# EAGLE board PX4FMUv1.7 (EAGLE 6.2)
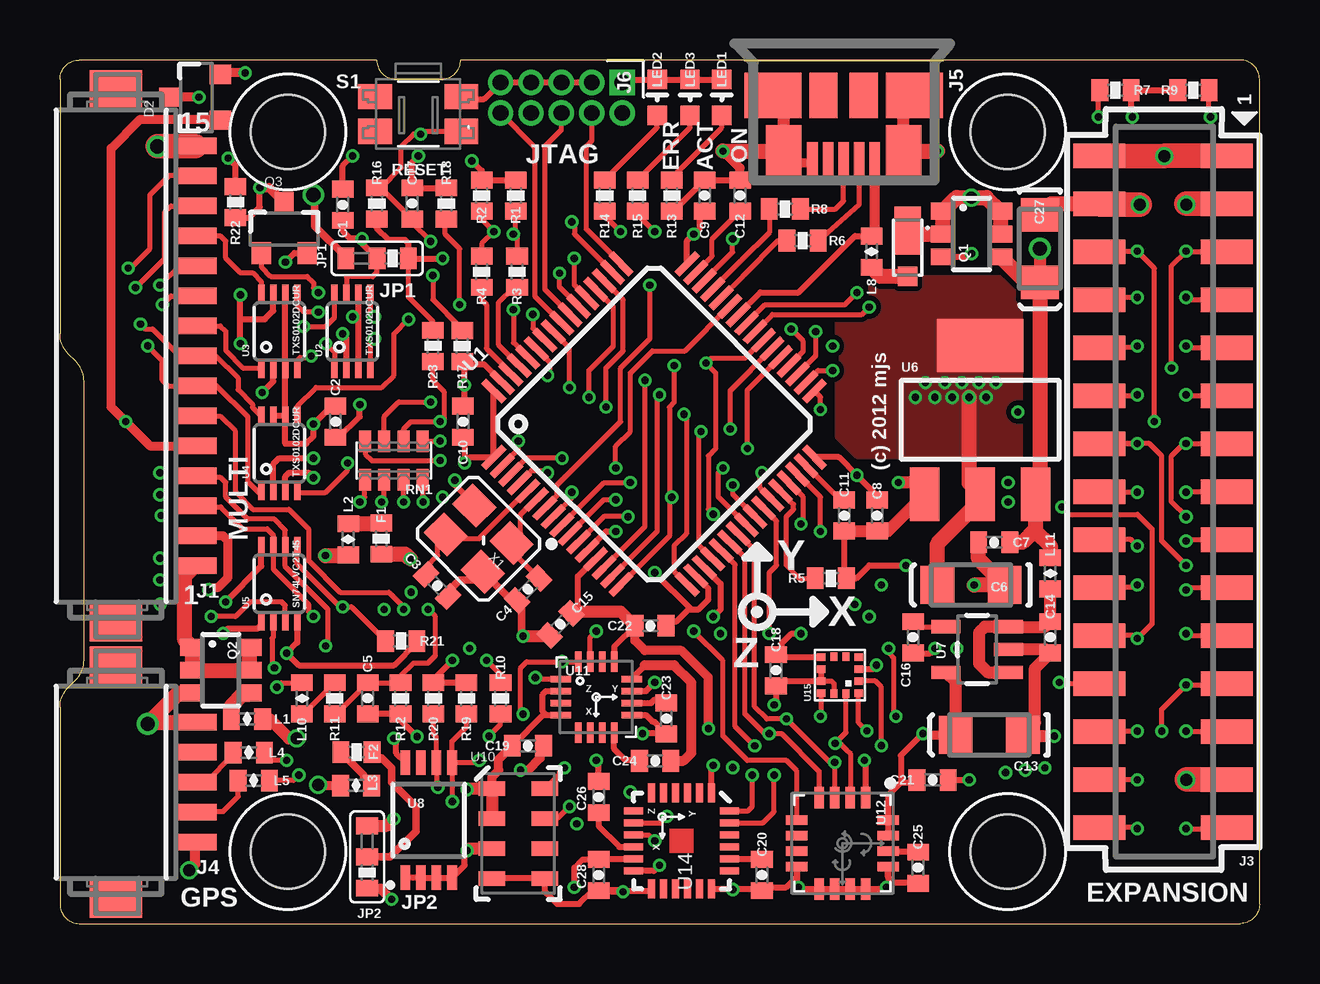
[diagram p3: board, top side]
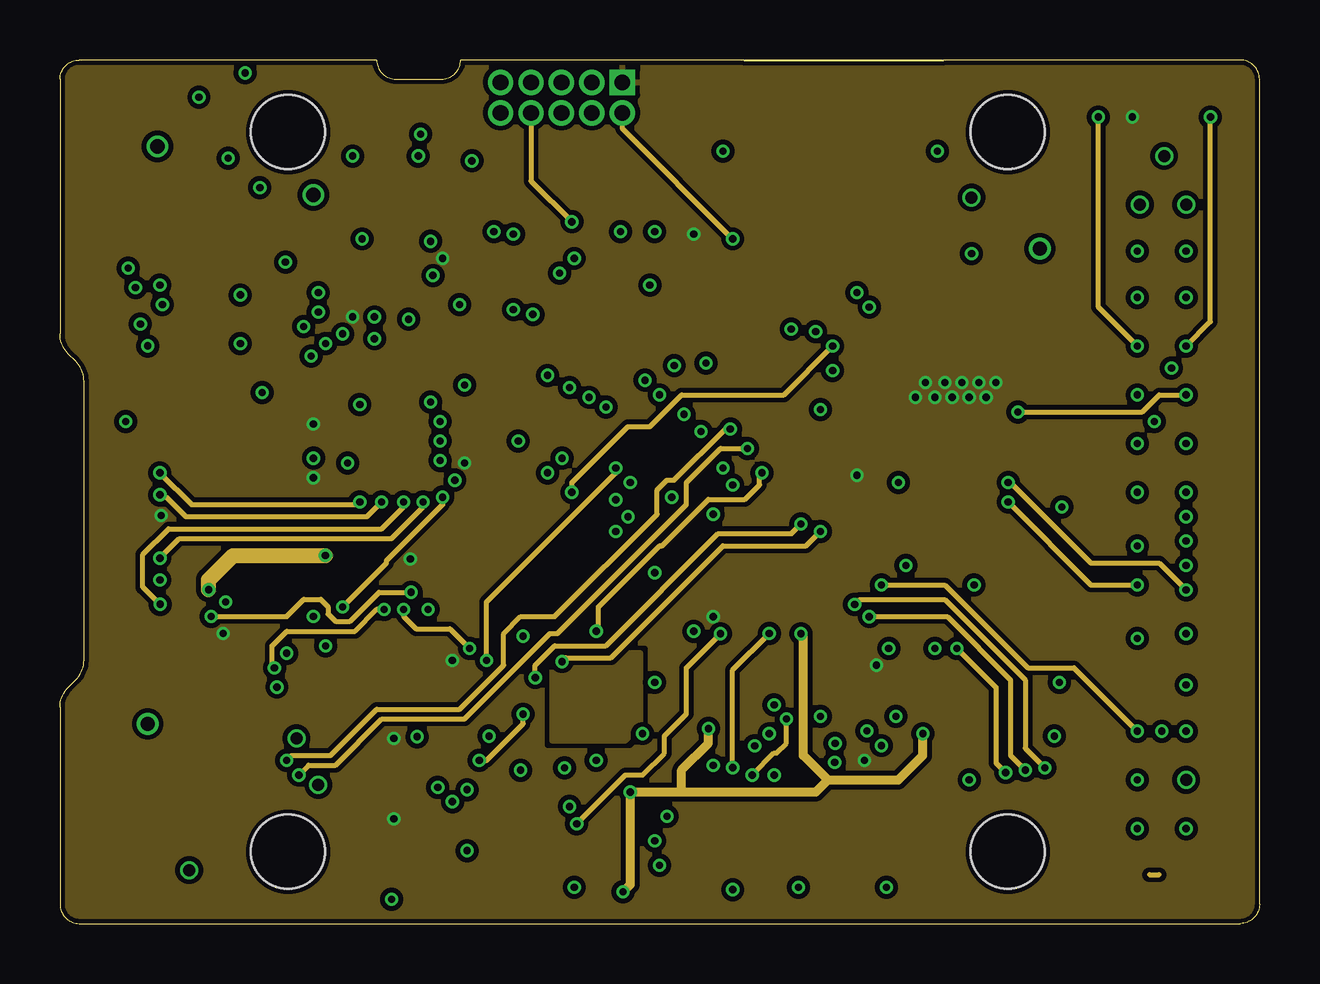
[diagram p4: board, inner layer Route2]
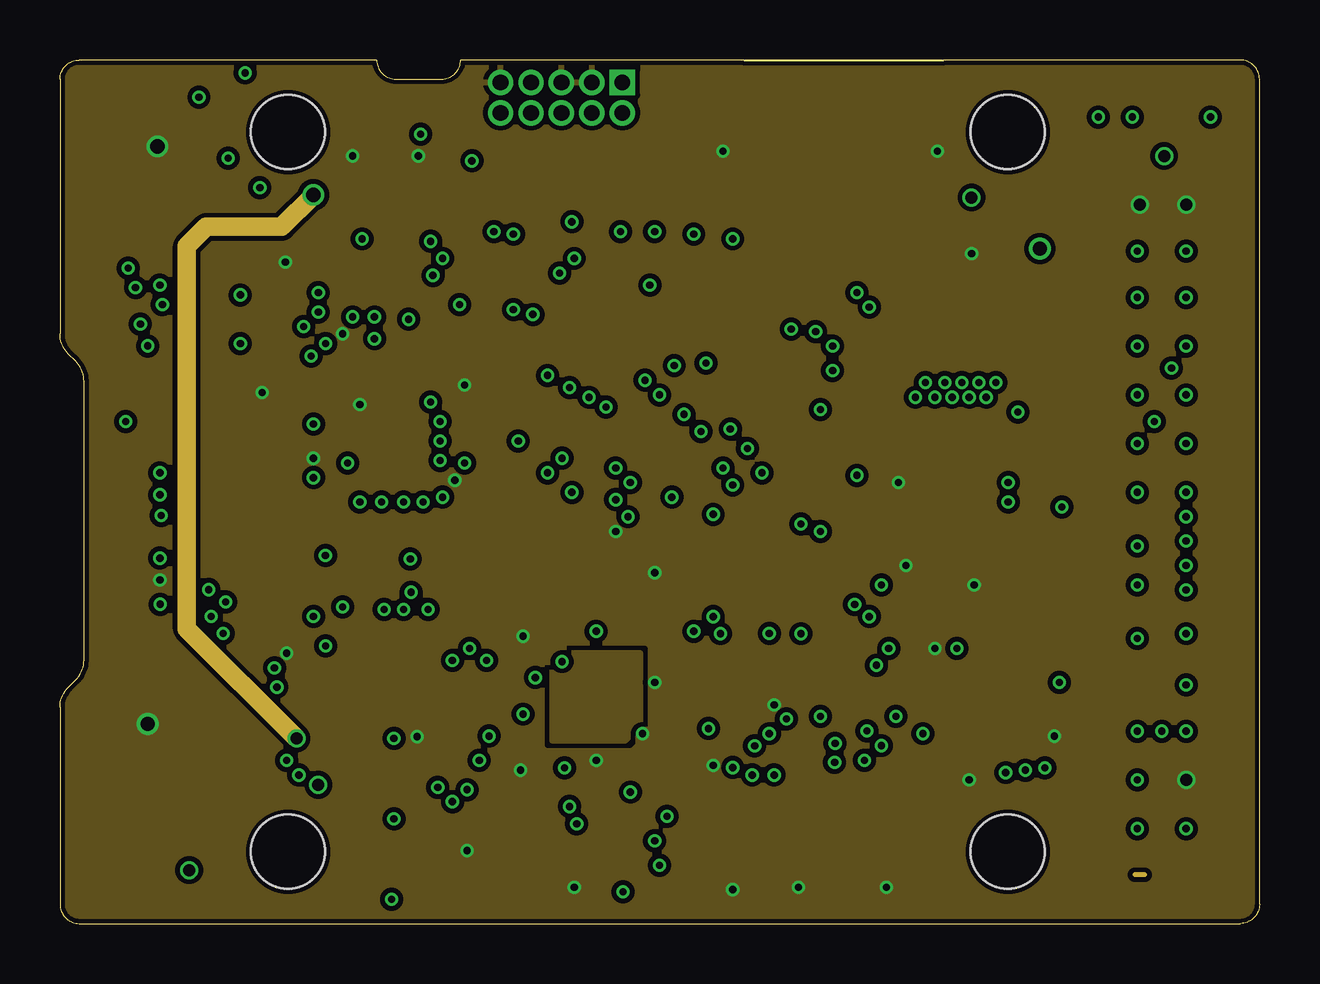
[diagram p5: board, inner layer Route15]
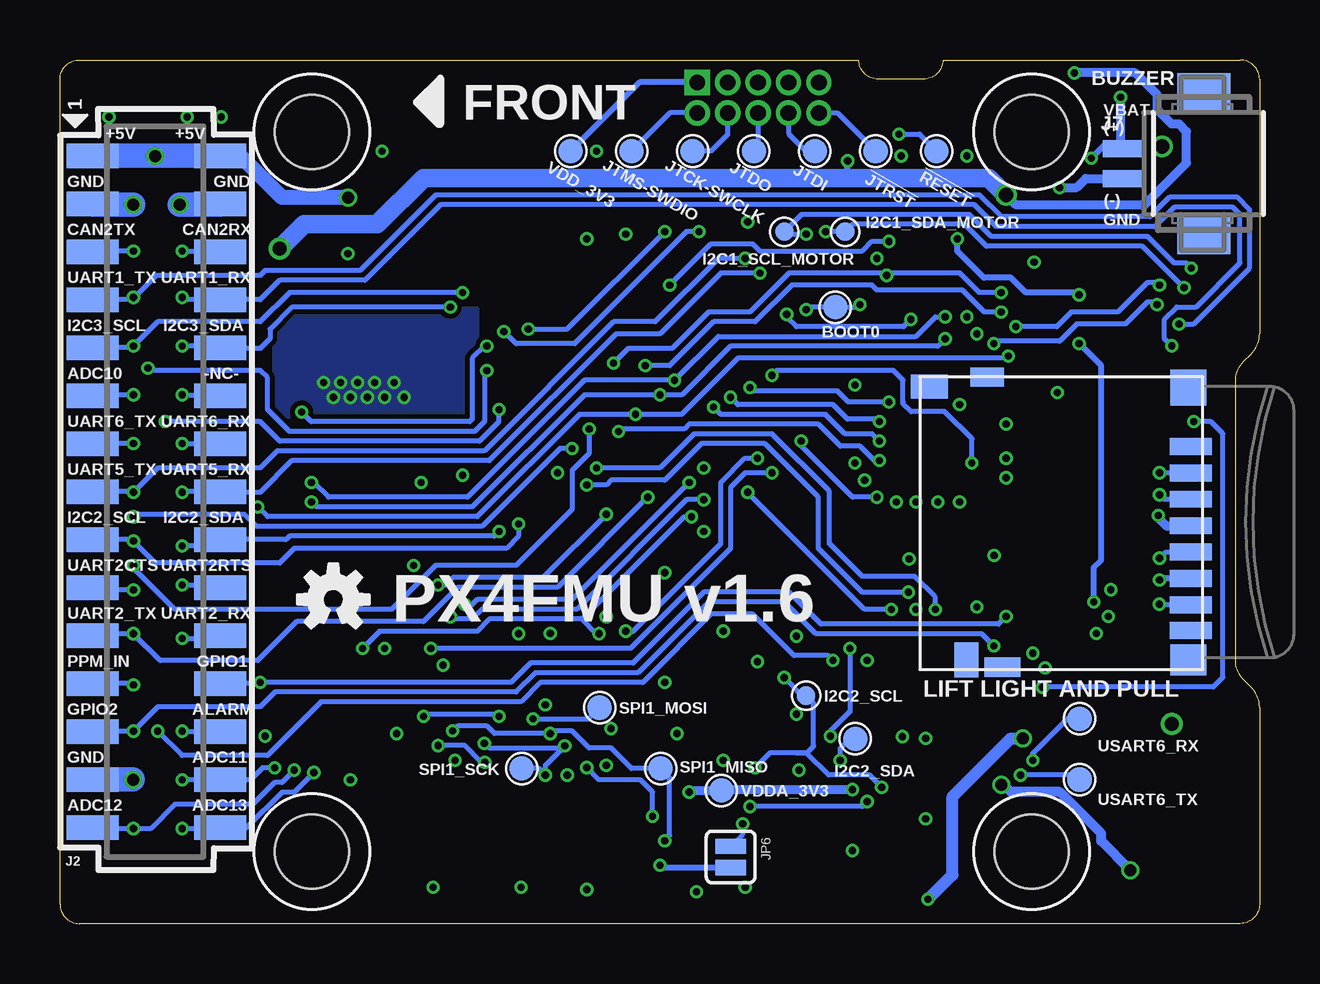
[diagram p6: board, bottom side, seen from below]

Size 50 x 36 mm. Coordinates in mm from the lower left corner, seen from the top.
Outline: 0,0.8 arc90 0.8,0 49.2,0 arc90 50,0.8 50,35.2 arc90 49.2,36 16.7,36 arc-90 15.9,35.2 14,35.2 arc-90 13.2,36 0.8,36 arc90 0,35.2 0,24.6 arc45 0.35,23.75 0.65,23.45 arc-45 1,22.6 1,11 arc-45 0.65,10.15 0.35,9.85 arc45 0,9 0,0.8
Copper layers (1*2*15*16): Top 0.035mm / dielectric 0.5mm / Route2 0.035mm / dielectric 0.5mm / Route15 0.035mm / dielectric 0.5mm / Bottom 0.035mm
Design rules: minimum track width 0.15mm, minimum drill 0.3mm, track to track 0.15mm, track to pad 0.15mm, pad to pad 0.15mm, via to via 0.15mm, smd to smd 0.15mm, copper to edge 0.2mm, drill to drill 0.2mm, minimum pad ring 0.125mm, minimum via ring 0.125mm, stop-mask expansion 1mil, vias tented up to drill 0.31mm, thermal gap 8mil
Net classes: 0 signal: width 0.203 mm, drill 0.3 mm, clearance 0.203 mm; 1 power: width 0.254 mm, drill 0.3 mm, clearance 0.203 mm

## Footprints (pad centres in the part's own frame; a part is rotated, then mirrored left to right if it is on the bottom)
PAD.04X.04 = smd 1.016 x 1.016: P$1 0,0
0402-CAP = smd 0.7 x 0.9: 1 -0.65,0; 2 0.65,0
EIA3216 = smd 1.4 x 1.6: A 1.4,0; C -1.4,0
MICROSMP = smd 0.8 x 0.8: ANODE 0.65,0 | smd 2 x 1.1: CATHODE -1.25,0
SOT23-3 = smd 0.8 x 0.9: 1 -0.95,-1; 2 0.95,-1; 3 0,1.1
0402-PTC = smd 0.7 x 0.9: 1 -0.65,0; 2 0.65,0
PAD.03X.03 = smd 0.762 x 0.762: P$1 0,0
DF13A-15P-1.25H = smd 0.7 x 1.8: 1 -8.75,-3.3; 2 -7.5,-3.3; 3 -6.25,-3.3; 4 -5,-3.3; 5 -3.75,-3.3; 6 -2.5,-3.3; 7 -1.25,-3.3; 8 0,-3.3; 9 1.25,-3.3; 10 2.5,-3.3; 11 3.75,-3.3; 12 5,-3.3; 13 6.25,-3.3; 14 7.5,-3.3; 15 8.75,-3.3 | smd 1.6 x 2.2: S1 11.1,0; S2 -11.1,0
HEADER_2MM_2X15_REVERSE = smd 1.02 x 2.16: 1 -14,-2.655; 2 -14,2.655; 3 -12,-2.655; 4 -12,2.655; 5 -10,-2.655; 6 -10,2.655; 7 -8,-2.655; 8 -8,2.655; 9 -6,-2.655; 10 -6,2.655; 11 -4,-2.655; 12 -4,2.655; 13 -2,-2.655; 14 -2,2.655; 15 0,-2.655; 16 0,2.655; 17 2,-2.655; 18 2,2.655; 19 4,-2.655; 20 4,2.655; 21 6,-2.655; 22 6,2.655; 23 8,-2.655; 24 8,2.655; 25 10,-2.655; 26 10,2.655; 27 12,-2.655; 28 12,2.655; 29 14,-2.655; 30 14,2.655
HEADER_2MM_2X15 = smd 1.02 x 2.16: 1 14,-2.655; 2 14,2.655; 3 12,-2.655; 4 12,2.655; 5 10,-2.655; 6 10,2.655; 7 8,-2.655; 8 8,2.655; 9 6,-2.655; 10 6,2.655; 11 4,-2.655; 12 4,2.655; 13 2,-2.655; 14 2,2.655; 15 0,-2.655; 16 0,2.655; 17 -2,-2.655; 18 -2,2.655; 19 -4,-2.655; 20 -4,2.655; 21 -6,-2.655; 22 -6,2.655; 23 -8,-2.655; 24 -8,2.655; 25 -10,-2.655; 26 -10,2.655; 27 -12,-2.655; 28 -12,2.655; 29 -14,-2.655; 30 -14,2.655
DF13A-5P-1.25H = smd 0.7 x 1.8: 1 -2.5,-3.3; 2 -1.25,-3.3; 3 0,-3.3; 4 1.25,-3.3; 5 2.5,-3.3 | smd 1.6 x 2.2: S1 4.85,0; S2 -4.85,0
MOLEX-47346-0001 = smd 1.7 x 0.44: D+ 2.8,0; D- 2.8,0.65; GND 2.8,-1.3; ID 2.8,-0.65; VBUS 2.8,1.3 | smd 1.9 x 2.375: GND1 0,2.95; GND4 0,-2.95 | smd 2.1 x 1.475: GND2 2.3,2.5; GND3 2.3,-2.5 | smd 1.9 x 1.175: GND5 0,-0.838; GND6 0,0.838
FTSH-105-01-XXX-DV = drill 0.65 pad 1.06 square: 1 0,0 | drill 0.65 pad 1.06: 2 0,1.27; 3 1.27,0; 4 1.27,1.27; 5 2.54,0; 6 2.54,1.27; 7 3.81,0; 8 3.81,1.27; 9 5.08,0; 10 5.08,1.27
DF13A-2P-1.25H = smd 0.7 x 1.8: 1 -0.605,-3.3; 2 0.645,-3.3 | smd 1.6 x 2.2: S1 2.995,0; S2 -2.955,0
SJ_3_0603_PASTE1&2 = smd 0.7 x 0.9: 1 -0.65,0; 2 0.65,0; 3 1.95,0
SJ_2 = smd 0.635 x 1.27: 1 -0.889,0; 2 0,0
0402-IND = smd 0.7 x 0.9: 1 -0.65,0; 2 0.65,0
LED-0603 = smd 0.8 x 0.8: A 0,-0.75; C 0,0.75
TSOP-6@1 = smd 0.7 x 1: 1 -0.95,-1.2; 2 0,-1.2; 3 0.95,-1.2; 4 0.95,1.2; 5 0,1.2; 6 -0.95,1.2
0402-RES = smd 0.7 x 0.9: 1 -0.65,0; 2 0.65,0
CTS742C083 = smd 0.5 x 0.9: 1 -1.2,-0.8; 2 -0.4,-0.8; 3 0.4,-0.8; 4 1.2,-0.8; 5 1.2,0.8; 6 0.4,0.8; 7 -0.4,0.8; 8 -1.2,0.8
EVQP7J01K = smd 1.4 x 1.05: A1 -1.8,0.725; A2 1.8,0.725; B3 -1.8,-0.725; B4 1.8,-0.725
TQFP64 = smd 1.2 x 0.29: 1 -5.7,3.75; 2 -5.7,3.25; 3 -5.7,2.75; 4 -5.7,2.25; 5 -5.7,1.75; 6 -5.7,1.25; 7 -5.7,0.75; 8 -5.7,0.25; 9 -5.7,-0.25; 10 -5.7,-0.75; 11 -5.7,-1.25; 12 -5.7,-1.75; 13 -5.7,-2.25; 14 -5.7,-2.75; 15 -5.7,-3.25; 16 -5.7,-3.75; 33 5.7,-3.75; 34 5.7,-3.25; 35 5.7,-2.75; 36 5.7,-2.25; 37 5.7,-1.75; 38 5.7,-1.25; 39 5.7,-0.75; 40 5.7,-0.25; 41 5.7,0.25; 42 5.7,0.75; 43 5.7,1.25; 44 5.7,1.75; 45 5.7,2.25; 46 5.7,2.75; 47 5.7,3.25; 48 5.7,3.75 | smd 0.29 x 1.2: 17 -3.75,-5.7; 18 -3.25,-5.7; 19 -2.75,-5.7; 20 -2.25,-5.7; 21 -1.75,-5.7; 22 -1.25,-5.7; 23 -0.75,-5.7; 24 -0.25,-5.7; 25 0.25,-5.7; 26 0.75,-5.7; 27 1.25,-5.7; 28 1.75,-5.7; 29 2.25,-5.7; 30 2.75,-5.7; 31 3.25,-5.7; 32 3.75,-5.7; 49 3.75,5.7; 50 3.25,5.7; 51 2.75,5.7; 52 2.25,5.7; 53 1.75,5.7; 54 1.25,5.7; 55 0.75,5.7; 56 0.25,5.7; 57 -0.25,5.7; 58 -0.75,5.7; 59 -1.25,5.7; 60 -1.75,5.7; 61 -2.25,5.7; 62 -2.75,5.7; 63 -3.25,5.7; 64 -3.75,5.7
TI-DCU = smd 0.27 x 0.8: 1 -0.75,-1.55; 2 -0.25,-1.55; 3 0.25,-1.55; 4 0.75,-1.55; 5 0.75,1.55; 6 0.25,1.55; 7 -0.25,1.55; 8 -0.75,1.55
SOT-223 = smd 1.219 x 2.235: 1 -2.311,-3.099; 2 0,-3.099; 3 2.311,-3.099 | smd 3.6 x 2.2: 4 0,3.099
SOT23-5 = smd 0.55 x 1.2: 1 -0.95,-1.3; 2 0,-1.3; 3 0.95,-1.3; 4 0.95,1.3; 5 -0.95,1.3
MSOP-8 = smd 0.4 x 1.02: 1 -0.975,-2.4; 2 -0.325,-2.4; 3 0.325,-2.4; 4 0.975,-2.4; 5 0.975,2.4; 6 0.325,2.4; 7 -0.325,2.4; 8 -0.975,2.4
MS5611-01BA = smd 1.1 x 0.6: 1 -1.1,1.875; 2 -1.1,0.625; 3 -1.1,-0.625; 4 -1.1,-1.875; 5 1.1,-1.875; 6 1.1,-0.625; 7 1.1,0.625; 8 1.1,1.875
HMC5883L-MAN = smd 0.85 x 0.285: 1 -1.475,0.75; 2 -1.475,0.25; 3 -1.475,-0.25; 4 -1.475,-0.75; 9 1.475,-0.75; 10 1.475,-0.25; 11 1.475,0.25; 12 1.475,0.75 | smd 0.285 x 0.85: 5 -0.75,-1.475; 6 -0.25,-1.475; 7 0.25,-1.475; 8 0.75,-1.475; 13 0.75,1.475; 14 0.25,1.475; 15 -0.25,1.475; 16 -0.75,1.475
L3G4200DH-MAN = smd 0.9 x 0.4: 1 -1.9,0.975; 2 -1.9,0.325; 3 -1.9,-0.325; 4 -1.9,-0.975; 9 1.9,-0.975; 10 1.9,-0.325; 11 1.9,0.325; 12 1.9,0.975 | smd 0.4 x 0.9: 5 -0.975,-1.9; 6 -0.325,-1.9; 7 0.325,-1.9; 8 0.975,-1.9; 13 0.975,1.9; 14 0.325,1.9; 15 -0.325,1.9; 16 -0.975,1.9
AMPHENOL_114-00841-68 = smd 0.7 x 1.75: P$1 7.7,-1; P$2 6.6,-1; P$3 5.5,-1; P$4 4.4,-1; P$5 3.3,-1; P$6 2.2,-1; P$7 1.1,-1; P$8 0.04,-1 | smd 1.5 x 1.5: P$9 10.15,-0.9 | smd 1.3 x 1.5: P$10 -1.2,-0.9 | smd 0.8 x 1.5: P$11 -1.5,6.85 | smd 1.45 x 1: P$12 -1.2,8.35 | smd 0.8 x 1.4: P$13 10.6,7.5 | smd 1 x 1.55: P$14 10.2,9.9
QFN-24 = smd 0.8 x 0.29: 1 -2,1.25; 2 -2,0.75; 3 -2,0.25; 4 -2,-0.25; 5 -2,-0.75; 6 -2,-1.25; 13 2,-1.25; 14 2,-0.75; 15 2,-0.25; 16 2,0.25; 17 2,0.75; 18 2,1.25 | smd 0.29 x 0.8: 7 -1.25,-2; 8 -0.75,-2; 9 -0.25,-2; 10 0.25,-2; 11 0.75,-2; 12 1.25,-2; 19 1.25,2; 20 0.75,2; 21 0.25,2; 22 -0.25,2; 23 -0.75,2; 24 -1.25,2
BMA280 = smd 0.3 x 0.35: 1 -0.75,-0.775; 2 -0.25,-0.775; 3 0.25,-0.775; 4 0.75,-0.775; 7 0.75,0.775; 8 0.25,0.775; 9 -0.25,0.775; 10 -0.75,0.775 | smd 0.35 x 0.3: 5 0.775,-0.25; 6 0.775,0.25; 11 -0.775,0.25; 12 -0.775,-0.25
MOUNT-HOLE3.1 = hole 3.1: 0,0
OSCILLATOR-3.2X2.5 = smd 1.4 x 1.2: 1 -1.1,-0.85; 2 1.1,-0.85; 3 1.1,0.85; 4 -1.1,0.85

## Placement (x,y rotation side)
!JTRST  PAD.04  [PAD.04X.04]  16,32.2 315 bottom
!RESET  PAD.04  [PAD.04X.04]  13.46,32.2 315 bottom
BOOT0  PAD.04  [PAD.04X.04]  17.68,25.7 0 bottom
C1  0u1  [0402-CAP]  11.79,29.96 90 top
C2  0u1  [0402-CAP]  11.48,20.92 270 top
C3  8p  [0402-CAP]  15.72,14.09 315 top
C4  8p  [0402-CAP]  19.51,13.93 45 top
C5  0u1  [0402-CAP]  12.83,9.39 270 top
C6  10u  [EIA3216]  37.97,14.11 180 top
C7  0u1  [0402-CAP]  38.94,15.89 180 top
C8  0u1  [0402-CAP]  34.06,17.01 270 top
C9  0u1  [0402-CAP]  26.87,30.34 90 top
C10  0u1  [0402-CAP]  16.8,20.92 90 top
C11  2u2  [0402-CAP]  32.69,17.01 270 top
C12  2u2  [0402-CAP]  28.35,30.34 90 top
C13  10u  [EIA3216]  38.73,7.87 180 top
C14  0u1  [0402-CAP]  41.27,11.93 270 top
C15  0u1  [0402-CAP]  20.86,12.47 225 top
C16  470p  [0402-CAP]  35.56,11.93 270 top
C17  0u1  [0402-CAP]  14.68,30.01 270 top
C18  0u1  [0402-CAP]  29.84,10.56 270 top
C19  0u1  [0402-CAP]  19.51,7.41 0 top
C20  0u01  [0402-CAP]  29.26,2.02 270 top
C21  0u1  [0402-CAP]  36.37,5.99 0 top
C22  0u1  [0402-CAP]  24.61,12.41 0 top
C23  4u7  [0402-CAP]  25.27,8.55 270 top
C24  0u22  [0402-CAP]  24.81,6.78 0 top
C25  0u01  [0402-CAP]  35.76,2.33 270 top
C26  2u2  [0402-CAP]  22.45,5.28 90 top
C27  10u  [EIA3216]  40.84,28.14 270 top
C28  2u2  [0402-CAP]  22.45,2.02 90 top
D1  MSS1P4-M3  [MICROSMP]  35.33,27.63 270 top
D2  BAT54C  [SOT23-3]  5.69,34.44 90 top
F1  500mA  [0402-PTC]  13.39,16.04 90 top
F2  200mA  [0402-PTC]  12.36,7.14 180 top
I2C1_SCL_MOTOR  PAD.03  [PAD.03X.03]  19.81,28.84 0 bottom
I2C1_SDA_MOTOR  PAD.03  [PAD.03X.03]  17.27,28.84 0 bottom
I2C2_SCL  PAD.03  [PAD.03X.03]  18.9,9.5 0 bottom
I2C2_SDA  PAD.04  [PAD.04X.04]  16.85,7.7 0 bottom
J1  DF13-15P-1.25H  [DF13A-15P-1.25H]  2.34,23.66 90 top
J2  HEADER_2X15-REV  [HEADER_2MM_2X15_REVERSE]  45.97,18.01 270 bottom
J3  HEADER_2X15  [HEADER_2MM_2X15]  45.97,18.01 90 top
J4  DF13-5P-1.25H  [DF13A-5P-1.25H]  2.34,5.89 90 top
J5  47346-0001  [MOLEX-47346-0001]  32.66,34.53 270 top
J6  ARM_MINI_JTAG-TH  [FTSH-105-01-XXX-DV]  23.44,35.07 180 top
J7  DF13-2P-1.25H  [DF13A-2P-1.25H]  2.33,31.7 270 bottom
JP1  0R  [SJ_3_0603_PASTE1&2]  13.87,27.73 180 top
JP2  0R  [SJ_3_0603_PASTE1&2]  12.8,2.13 90 top
JP6  JUMPER-2  [SJ_2]  22.05,2.33 270 bottom
JTCK-SWCLK  PAD.04  [PAD.04X.04]  23.63,32.2 315 bottom
JTDI  PAD.04  [PAD.04X.04]  18.54,32.2 315 bottom
JTDO  PAD.04  [PAD.04X.04]  21.08,32.2 315 bottom
JTMS-SWDIO  PAD.04  [PAD.04X.04]  26.17,32.2 315 bottom
L1  FERRITE  [0402-IND]  7.8,8.53 180 top
L2  FERRITE  [0402-IND]  12.01,16.02 270 top
L3  FERRITE  [0402-IND]  12.34,5.76 180 top
L4  BLM15HD102SN1  [0402-IND]  7.87,7.13 180 top
L5  BLM15HD102SN1  [0402-IND]  8.08,5.96 180 top
L8  FERRITE  [0402-IND]  33.83,28.01 90 top
L10  BLM15HD102SN1  [0402-IND]  10.08,9.39 90 top
L11  FERRITE  [0402-IND]  41.27,14.6 270 top
LED1  GREEN  [LED-0603]  27.58,34.43 180 top
LED2  AMBER  [LED-0603]  24.89,34.43 180 top
LED3  BLUE  [LED-0603]  26.26,34.43 180 top
Q1  NTGS4111P  [TSOP-6@1]  38,28.74 270 top
Q2  NTGS4111P  [TSOP-6@1]  6.71,10.56 270 top
Q3  ZXMS6004FFTA  [SOT23-3]  9.35,28.95 0 top
R1  1K5  [0402-RES]  19,30.34 90 top
R2  1K5  [0402-RES]  17.58,30.34 90 top
R3  100  [0402-RES]  19.05,27.17 90 top
R4  100  [0402-RES]  17.58,27.17 90 top
R5  10K  [0402-RES]  32.13,14.39 0 top
R6  22R  [0402-RES]  30.96,28.47 180 top
R7  1K5  [0402-RES]  43.99,34.74 0 top
R8  22R  [0402-RES]  30.22,29.78 180 top
R9  1K5  [0402-RES]  47.24,34.74 180 top
R10  1K0  [0402-RES]  18.36,9.39 270 top
R11  47K/0.1%  [0402-RES]  11.46,9.39 90 top
R12  10K/0.1%  [0402-RES]  14.2,9.39 90 top
R13  270R  [0402-RES]  25.5,30.34 90 top
R14  270R  [0402-RES]  22.71,30.34 90 top
R15  82R  [0402-RES]  24.08,30.34 90 top
R16  10K  [0402-RES]  13.21,30.01 270 top
R17  10K  [0402-RES]  16.76,24.07 90 top
R18  10K  [0402-RES]  16.1,30.01 270 top
R19  1K5  [0402-RES]  16.94,9.39 90 top
R20  1K5  [0402-RES]  15.57,9.39 90 top
R21  10K  [0402-RES]  14.22,11.78 180 top
R22  10K  [0402-RES]  7.32,30.07 90 top
R23  10K  [0402-RES]  15.54,24.08 90 top
RN1  CTS742C083  [CTS742C083]  13.92,19.3 180 top
S1  RESET  [EVQP7J01K]  14.94,33.75 180 top
SPI1_MISO  PAD.04  [PAD.04X.04]  24.97,6.46 315 bottom
SPI1_MOSI  PAD.04  [PAD.04X.04]  27.51,9 0 bottom
SPI1_SCK  PAD.04  [PAD.04X.04]  30.76,6.46 315 bottom
U1  STM32F405RGT6  [TQFP64]  24.77,20.82 45 top
U2  TXS0102DCUR  [TI-DCU]  12.19,24.68 0 top
U3  TXS0102DCUR  [TI-DCU]  9.14,24.68 0 top
U4  TXS0102DCUR  [TI-DCU]  9.14,19.6 0 top
U5  SN74LVC2T45  [TI-DCU]  9.14,14.17 0 top
U6  LD1117AS33  [SOT-223]  38.35,21 0 top
U7  MIC5207  [SOT23-5]  38.23,11.42 90 top
U8  128KBit EEPROM  [MSOP-8]  15.37,4.31 0 top
U10  MS5611-01BA  [MS5611-01BA]  19.1,3.75 0 top
U11  HMC5883L  [HMC5883L-MAN]  22.35,9.44 0 top
U12  L3GD20  [L3G4200DH-MAN]  32.61,3.34 270 top
U13  AMP 114-00841-68  [AMPHENOL_114-00841-68]  3.86,12.18 90 bottom
U14  MPU-6000  [QFN-24]  25.91,3.45 270 top
U15  BMA280  [BMA280]  32.51,10.36 90 top
U$1  MOUNT-HOLE3.1MM  [MOUNT-HOLE3.1]  39.5,3 0 top
U$2  MOUNT-HOLE3.1MM  [MOUNT-HOLE3.1]  9.5,33 0 top
U$3  MOUNT-HOLE3.1MM  [MOUNT-HOLE3.1]  9.5,3 0 top
U$4  MOUNT-HOLE3.1MM  [MOUNT-HOLE3.1]  39.5,33 0 top
U$7  OSHW-LOGOS  [OSHW-LOGO-S]  38.61,13.5 0 bottom
USART6_RX  PAD.04  [PAD.04X.04]  7.5,8.54 0 bottom
USART6_TX  PAD.04  [PAD.04X.04]  7.5,6 0 bottom
VDD_3V3  PAD.04  [PAD.04X.04]  28.71,32.2 315 bottom
VDDA_3V3  PAD.04  [PAD.04X.04]  22.43,5.55 0 bottom
X1  24 MHz 3.2x2.5mm 8-10pf  [OSCILLATOR-3.2X2.5]  17.45,16.04 135 top

## Tracks (layer width: path | path; a pad name or v marks a point on that pad's centre or on a via)
!JTRST
  Top 0.203: U1.56 19.81,26.13 19.81,32.35 J6.10
  Bottom 0.203: !JTRST.P$1 17.6,33.8 J6.10
ACCEL_CS  (via drill 0.3)
  Top 0.203: U1.4 19.65,18.89 20.22,18.89 v20.32,18.79 | v34.54,11.47 34.54,11.28 34.75,11.07 34.75,8.74 v34.85,8.64 | U15.10 31.74,8.67 v31.7,8.64
  Bottom 0.203: v20.32,18.79 21.44,18.79 22.05,18.18 22.05,15.64 26.21,11.47 v34.54,11.47 | v34.85,8.64 34.75,8.74 31.8,8.74 v31.7,8.64
ADC123_IN10  (via drill 0.3)
  Top 0.203: v21.34,17.98 21.34,17.74 U1.8 | R11.1 11.53,8.74 C5.1 R12.2 14.22,10.06 14.22,10.36 14.73,10.86 15.34,10.86 15.65,11.17 15.65,12.79 v15.34,13.1 | J3.11 46.97,22.01 v46.94,22.04
  Route2 0.203: v21.34,17.98 21.34,18.38 23.67,20.72 24.59,20.72 25.91,22.04 30.18,22.04 v32.21,24.07 | v39.93,21.33 45.11,21.33 45.82,22.04 v46.94,22.04
  Bottom 0.203: v15.34,13.1 16.46,13.1 v21.34,17.98 | v46.94,22.04 48.6,22.04 J3.11 | v32.21,24.07 32.31,24.07 32.82,23.56 32.82,21.02 32.92,20.92 39.52,20.92 v39.93,21.33
ADC123_IN11  (via drill 0.3, 0.3 pad 0.51)
  Top 0.203: v23.77,18.38 22.68,18.38 U1.9 | J2.28 43.3,5.99 v44.91,5.99
  Route2 0.203: v33.12,13.3 33.33,13.51 36.88,13.51 40.23,10.15 40.23,7.31 v41.05,6.49
  Bottom 0.203: v23.77,18.38 28.65,13.51 32.61,13.51 32.82,13.3 v33.12,13.3 | 43.3,5.99 v44.91,5.99 | v41.05,6.49 41.55,6.49 42.06,5.99 43.3,5.99 | 43.3,5.99 J2.28
ADC123_IN12  (via drill 0.3, 0.3 pad 0.51)
  Top 0.203: v23.16,17.67 22.68,17.67 U1.10 | J2.29 48.58,3.95 v46.94,3.95
  Route2 0.203: v40.23,6.39 39.62,7 39.62,10.15 36.98,12.79 v33.73,12.79
  Bottom 0.203: v23.16,17.67 23.88,17.67 28.45,13.1 32.41,13.1 32.82,12.69 33.63,12.69 v33.73,12.79 | J2.29 48.58,3.95 v46.94,3.95 46.23,3.95 45.21,4.97 41.96,4.97 41.05,5.88 40.74,5.88 v40.23,6.39
ADC123_IN13  (via drill 0.3, 0.3 pad 0.51)
  Top 0.203: v23.67,16.96 22.67,16.96 U1.11 | J2.30 44.85,4.01 v44.91,3.95
  Route2 0.203: v37.39,11.47 39.01,9.85 39.01,6.7 v39.42,6.29 | v27.53,12.08 26.11,10.66 26.11,8.73 25.2,7.82 25.2,7.1 24.28,6.19 23.57,6.19 v21.54,4.16
  Bottom 0.203: v23.67,16.96 23.98,16.96 28.25,12.69 | 28.25,12.69 32.11,12.69 32.61,12.18 36.68,12.18 v37.39,11.47 | J2.30 43.27,3.95 | v44.91,3.95 43.37,3.95 J2.30 | J2.30 42.21,4.01 40.74,5.48 40.23,5.48 v39.42,6.29 | v27.53,12.08 27.64,12.08 28.25,12.69 | v21.54,4.16 21.54,3.73 JP6.1
ALARM  (via drill 0.3)
  Top 0.203: U1.39 29.31,24.32 28.55,23.56 27.13,23.56 v26.92,23.36 27.33,22.95 27.33,19.8 27.03,19.5 27.03,17.26 v27.23,17.06 | v44.91,8.02 J2.26 | R17.2 16.76,24.89 16.66,24.89 15.54,26.01 v15.54,27.02 | Q3.1 8.4,27.37 8.79,26.98 10.31,26.98 10.57,26.72 10.57,26.51 v10.77,26.31
  Route2 0.203: v34.24,14.11 36.88,14.11 40.34,10.66 42.27,10.66 v44.91,8.02
  Bottom 0.203: J2.26 44.9,8.01 v44.91,8.02 | v27.23,17.06 29.87,14.42 33.63,14.42 33.93,14.11 v34.24,14.11 | v26.92,23.36 26.31,23.97 24.49,23.97 22.96,25.49 21.23,25.49 19.61,27.12 15.54,27.12 | 15.54,27.12 12.5,27.12 11.68,26.31 v10.77,26.31 | 15.54,27.12 v15.54,27.02
BOOT0  (via drill 0.3)
  Top 0.203: v18.9,25.59 18.9,24.21 U1.60 | v16.66,25.8 16.66,28.14 16.05,28.75 16.05,29.31 R18.2
  Bottom 0.203: v18.9,25.59 18.8,25.7 BOOT0.P$1 16.76,25.7 v16.66,25.8
CAN2_RX  (via drill 0.3)
  Top 0.203: J2.6 44.88,28.01 v44.91,28.03 45.62,27.32 v45.62,20.92 | U1.33 31.7,21.95 v31.7,21.43
  Bottom 0.203: J2.6 43.34,28.03 v44.91,28.03 | v31.7,21.43 31.7,20.92 32.51,20.11 40.84,20.11 41.66,20.92 v45.62,20.92
CAN2_TX  (via drill 0.3)
  Top 0.203: J2.5 46.97,28.01 v46.94,28.03 46.33,27.42 v46.33,23.16 | v32.21,23.05 31.6,23.05 U1.34
  Bottom 0.203: J2.5 48.6,28.03 v46.94,28.03 | v46.33,23.16 46.23,23.05 41.66,23.05 41.35,22.75 41.35,21.43 40.44,20.52 32.72,20.52 32.31,20.92 32.31,22.95 v32.21,23.05
GND  (via drill 0.3, 0.5, 0.6)
  Top 0.203: U15.9 32.16,10.11 32.21,10.06 32.26,10 U15.11
  Top 0.254: C14.2 41.13,11.42 | C12.2 C9.2 25.6,29.73 25.53,29.73 | C5.2 R12.1 14.2,8.48 v14.88,7.79 | U8.1 U8.2 U8.3 U8.4 16.87,2.43 16.87,2.94 v16.97,3.04 | J6.3 J6.5 J6.9 17.67,34.37 16.84,34.37 S1.B3 | C11.2 32.69,14.48 R5.2 33.2,14.39 33.73,14.93 v35.26,14.93 | U1.18 27.03,13.96 27.03,13.51 26.62,13.1 26.31,13.1 | 40.64,8.37 C13.C 40.19,7.82 | v23.16,16.35 22.77,16.35 U1.12 | 30.28,32.2 30.18,32.2 30.16,32.19 J5.GND3 | v36.47,11.47 36.27,11.27 C16.2 | J2.4 43.36,29.96 | v46.94,29.96 46.94,30.01 | U6.1 35.56,18.38 | 25.53,29.73 25.4,29.73 | R13.1 25.53,29.73 | v46.94,5.99 46.96,6.01 | 25.26,7.92 24.75,8.43 24.69,8.43 24.42,8.69 U11.9 23.81,8.7 | 25.26,12.35 C22.2 25.45,12.6 25.7,12.6 26.2,13.1 26.31,13.1 | U5.4 9.89,11.71 v9.45,11.27 9.96,10.76 13.92,10.76 14.87,11.72 R21.1 | C27.C 41.32,30.01 | Q1.3 37.86,27.8 v38,27.93 | U3.2 8.89,22.6 v8.43,22.14 | U4.2 8.89,19.16 9.14,19.41 10.56,19.41 v10.57,19.4 | C10.2 16.87,21.5 v16.87,22.45 16.87,23.32 | 17.27,17.47 16.46,18.28 v16.46,18.48 | C2.2 11.64,20.27 12.5,21.12 v12.5,21.63 | U2.2 11.94,24.42 v11.79,24.58 | C1.2 11.79,31.59 v12.19,32 | R18.1 C17.1 14.68,31.74 v14.94,32 | 16.87,23.32 R17.1 | 16.87,23.32 17.67,23.32 U1.63 | U14.11 22.43,2.7 C28.2 21.78,2.67 21.44,2.33 v21.44,1.52 | 29.33,1.45 C20.2 | 29.33,1.45 29.4,1.52 30.28,1.52 30.71,1.95 U12.8 30.71,1.59 v30.79,1.52 30.86,1.45 U12.9 U12.10 U12.11 U12.12 34.37,1.45 v34.44,1.52 34.65,1.72 34.75,1.72 | 34.51,1.89 U12.13 34.51,1.95 34.75,1.72 | 34.75,1.72 35.72,1.72 C25.2 | C26.2 22.45,6.7 v22.35,6.8 | C21.2 v37.9,5.99 | U14.18 28.01,1.45 v28.04,1.41 28.07,1.45 29.33,1.45 | 26.31,13.1 v24.79,14.62 | U11.11 24.43,9.69 v24.79,10.05
  Top 0.254: 25.26,7.92 v24.28,7.92 | 25.26,7.92 C23.2 | v29.77,9.12 29.84,9.2 C18.2 30.04,10.11 U15.9 U15.8 | U14.1 27.16,6.53 v27.23,6.6 | Q3.2 9.77,27.95 v9.4,27.58
  Top 0.305: 19.23,13.27 19.23,12.05 v19.3,11.98 | 20.37,11.98 C15.2 | 19.23,13.27 19.02,13.27 X1.4 17.28,14.32 16.66,14.32 16.18,13.84 C3.2 | 19.23,13.27 19.23,13.29 C4.1 | X1.2 17.27,17.47
  Top 0.381: C16.2 35.7,11.42 | C19.2 20.02,7.27 20.02,6.9 19.51,6.39 v19.2,6.39 | J5.GND 30.66,31.73 J5.GND3 | 35.64,32.2 35.19,32.2 J5.GND2 | C12.2 28.35,31.5 28.14,31.7 v27.64,32.2
  Top 0.508: 41.13,11.42 U7.2 | C11.2 C8.2 34.5,16.36 U6.1 | C14.2 40.64,10.64 40.64,8.37 | 40.19,7.82 v41.45,7.82 | 35.56,18.38 v34.95,18.38 | v19.3,11.98 20.37,11.98 | U10.3 17.05,3.13 v16.97,3.04 | J5.GND4 29.71,34.29 30.18,33.83 30.18,32.24 J5.GND3 | J5.GND1 35.61,34.4 35.15,33.93 J5.GND2
  Top 0.635: v27.64,32.2 30.18,32.2 | 35.64,32.2 v36.58,32.2 | C7.2 38.29,15.2 C6.C v38.1,14.11 | 41.32,30.01 J2.4 | Q2.3 4.94,9.61 v3.66,8.32 3.73,8.39 J4.5
  Top 1.016: 43.36,29.96 v45.01,29.96 | 46.94,30.01 J2.3 | 46.96,6.01 J2.27 | J1.15 4.08,32.41 v4.06,32.4
  Bottom 0.254: 48.59,29.96 J2.3 | 43.36,29.96 J2.4 | v46.94,5.99 46.96,6.01 | U13.P$6 4.13,14.38 4.17,14.35 v4.17,14.32 | v22.35,6.8 22.45,6.7
  Bottom 1.016: v46.94,29.96 48.59,29.96 | v45.01,29.96 43.36,29.96 | 46.96,6.01 J2.27
  pour Route15 (rank 2): -0.41,36.46 -0.41,-0.3 50.7,-0.3 50.7,36.46
GPIO1  (via drill 0.3)
  Top 0.203: U1.24 27.43,17.8 27.43,18.79 v27.64,18.99 | U5.2 8.89,11.94 8.84,11.89 8.84,10.76 v8.94,10.66
  Route2 0.203: v8.94,10.66 v8.94,10.67 8.84,10.77 8.84,11.57 9.45,12.18 12.29,12.18 13.21,13.1 v13.51,13.1
  Bottom 0.203: v27.64,18.99 24.99,18.99 23.57,20.41 20.32,20.41 17.93,18.03 17.93,15.84 16.56,14.47 14.38,14.47 13.51,13.61 v13.51,13.1
GPIO2  (via drill 0.3)
  Top 0.203: U1.25 28.04,17.9 v28.04,18.28 | U5.3 9.39,13.26 9.25,13.41 7.92,13.41 7.32,12.8 v6.3,12.8
  Route2 0.203: v14.63,13.81 13.3,13.81 12.09,12.6 11.48,12.6 11.18,12.9 11.18,13.21 10.87,13.51 10.16,13.51 9.45,12.8 v6.3,12.8
  Bottom 0.203: v28.04,18.28 v28.04,18.29 27.23,18.29 27.03,18.48 24.79,18.48 23.27,20.01 20.62,20.01 18.39,17.77 18.39,15.64 16.56,13.81 v14.63,13.81
GPIO_DIR  (via drill 0.3)
  Top 0.203: U1.2 19.1,19.75 v19.1,20.11 | U5.5 9.89,14.99 11.68,13.2 v11.79,13.2 12.15,13.2 R21.2
  Route2 0.203: v15.95,17.77 15.95,17.47 13.61,15.13 13.61,15.03 v11.79,13.2
  Bottom 0.203: v15.95,17.77 16.97,17.77 19.1,19.91 v19.1,20.11
GPIO_EXT1  (via drill 0.3)
  Top 0.203: v41.66,10.05 41.7,10.01 J2.24 | J1.3 5.68,17.37 6.71,17.37 7.63,16.45 8.64,16.45 8.89,16.19 U5.7 8.89,14.77 8.9,14.77 10.36,13.31 10.36,13.01 v10.57,12.8
  Bottom 0.203: J2.24 41.7,10.01 v41.66,10.05 41.65,10.06 31.19,10.06 30.39,10.86 26.11,10.86 23.16,13.82 19.61,13.82 18.28,12.49 10.88,12.49 v10.57,12.8
GPIO_EXT2  (via drill 0.3)
  Top 0.203: v46.94,8.02 46.95,8.01 J2.25 | v11.07,11.57 11.18,11.68 11.18,13.1 9.39,14.88 U5.6 9.39,16.4 8.94,16.86 7.83,16.86 6.91,17.78 6.91,18.39 6.71,18.59 5.71,18.59 J1.4
  Bottom 0.203: J2.25 48.62,8.02 v46.94,8.02 45.92,9.03 41.66,9.03 41.04,9.65 30.99,9.65 30.18,10.46 25.91,10.46 22.95,13.41 19.81,13.41 18.48,12.08 11.58,12.08 v11.07,11.57
GYRO_CS  (via drill 0.3)
  Top 0.203: U1.3 19.45,19.4 v20.93,19.4 | v26.42,12.18 27.64,10.96 27.64,7.82 28.65,6.8 30.28,6.8 30.71,6.36 U12.5
  Bottom 0.203: v20.93,19.4 21.44,19.4 22.45,18.38 22.45,15.84 26.11,12.18 v26.42,12.18
I2C1_SCL
  Top 0.203: U1.61 18.29,24.11 18.29,25.9 18.91,26.52 R3.1
I2C1_SCL_EXT  (via drill 0.3)
  Top 0.203: R3.2 19.05,28.59 v18.9,28.75 19,28.85 R1.1 | J1.14 5.61,31.19 4.57,31.19 3.76,30.38 3.76,28.14 2.95,27.33 2.85,27.33 v2.85,27.32
  Bottom 0.203: v18.9,28.75 19.72,28.75 I2C1_SCL_MOTOR.P$1 19.09,29.56 12.09,29.56 11.18,28.64 4.67,28.64 3.56,27.53 3.06,27.53 v2.85,27.32
I2C1_SDA
  Top 0.203: U1.62 18.79,22.96 17.78,23.97 17.78,25.8 17.58,26 R4.1
I2C1_SDA_EXT  (via drill 0.3)
  Top 0.203: R4.2 17.58,28.34 v18.09,28.85 17.58,29.35 R2.1 | J1.13 4.62,29.91 4.37,29.67 4.37,27.73 v3.15,26.51
  Bottom 0.203: v3.15,26.51 4.88,28.24 11.38,28.24 12.29,29.15 16.96,29.15 I2C1_SDA_MOTOR.P$1 18.07,28.84 v18.09,28.85
I2C2_SCL  (via drill 0.3)
  Top 0.203: 15.65,8.66 R20.1 15.57,7.89 15.69,7.77 U8.6 15.69,5.74 v15.75,5.68 | v30.89,16.65 30.99,16.76 30.99,17.78 U1.29 | J2.17 47,16.01 v46.94,15.94 | U11.1 19.88,10.19 v19.81,10.25
  Top 0.254: U10.8 20.27,5.63 20.83,6.19 20.83,6.29 v21.03,6.49
  Route2 0.203: v30.89,16.65 30.89,16.66 30.47,16.25 30.46,16.26 27.43,16.26 22.76,11.58 20.62,11.58 19.81,10.77 v19.81,10.25
  Bottom 0.203: J2.17 47,16.01 v46.94,15.94 46.02,15.03 40.84,15.03 40.23,15.64 31.39,15.64 30.89,16.15 v30.89,16.65 | v15.75,5.68 16.26,6.19 17.96,6.19 18.88,7.1 | 18.88,7.1 19.3,7.1 | v19.81,10.25 19.06,9.5 I2C2_SCL.P$1 18.59,9.19 18.59,7.39 18.88,7.1 | v21.03,6.49 20.41,7.11 18.89,7.11 18.88,7.1
I2C2_SDA  (via drill 0.3, 0.3 pad 0.51)
  Top 0.203: U1.30 31.7,17.77 v31.7,16.35 | v44.91,15.74 44.64,16.01 J2.18 | v19.3,8.73 19.2,8.83 19.2,10.66 19.46,10.92 v20.93,10.92 U11.16 | U8.5 17.39,6.71 v17.48,6.8 | U8.5 16.34,7.6 16.94,8.2 R19.1 | U10.7 20.73,4.38 v21.23,4.88 | v16.36,5.08 16.36,6.69 U8.5
  Route2 0.203: v17.48,6.8 17.78,6.8 19.3,8.32 v19.3,8.73 | v20.93,10.92 21.09,11.07 22.96,11.07 27.64,15.75 31.1,15.75 v31.7,16.35
  Bottom 0.203: v44.91,15.74 43.59,15.74 J2.18 40.58,16.01 40.44,16.15 31.9,16.15 v31.7,16.35 | I2C2_SDA.P$1 17.08,7.7 17.48,7.31 v17.48,6.8 | v21.23,4.88 16.56,4.88 v16.36,5.08
I2C3_SCL  (via drill 0.3)
  Top 0.203: v46.94,24.07 47,24.01 J2.9 | R9.1 47.89,33.68 v47.95,33.62 | U1.41 29.39,25.8 32.72,25.8 v33.22,26.31
  Route2 0.203: v47.95,33.62 47.95,25.09 v46.94,24.07
  Bottom 0.203: J2.9 47,24.01 v46.94,24.07 45.92,25.09 41.66,25.09 40.44,26.31 v33.22,26.31
I2C3_SDA  (via drill 0.3, 0.3 pad 0.51)
  Top 0.203: v44.91,24.07 44.84,24.01 J2.10 | R7.1 43.28,34.74 v43.28,33.62 | U1.40 29.69,25.39 33.43,25.39 v33.73,25.7
  Route2 0.203: v43.28,33.62 43.28,25.7 v44.91,24.07
  Bottom 0.203: v44.91,24.07 43.38,24.07 J2.10 43.28,23.97 41.66,23.97 41.25,24.38 41.25,24.78 40.34,25.7 v33.73,25.7
JTCK-SWCLK
  Top 0.203: U1.49 21.95,28.94 21.95,32.4 22.17,32.63 J6.4
  Bottom 0.203: JTCK-SWCLK.P$1 22.86,32.2 22.17,32.88 J6.4
JTDI  (via drill 0.3)
  Top 0.203: U1.50 21.44,28.74 21.44,29.15 v21.34,29.25
  Route2 0.203: v21.34,29.25 19.63,30.95 J6.8
  Bottom 0.203: JTDI.P$1 18.9,32.2 19.61,32.91 19.61,33.77 J6.8
JTDO
  Top 0.203: U1.55 20.22,26.43 20.22,32.4 20.9,33.09 J6.6
  Bottom 0.203: JTDO.P$1 20.9,32.37 J6.6
JTMS-SWDIO  (via drill 0.3)
  Top 0.203: U1.46 28.04,27.99 v28.04,28.54
  Route2 0.203: v28.04,28.54 23.44,33.14 J6.2
  Bottom 0.203: JTMS-SWDIO.P$1 24.57,33.8 J6.2
LED_AMBER  (via drill 0.3)
  Top 0.203: v23.37,28.85 22.71,29.51 R14.1 | U1.35 31.5,23.66 v31.5,24.68
  Bottom 0.203: v31.5,24.68 30.99,24.17 28.55,24.17 23.88,28.85 v23.37,28.85
LED_BLUE  (via drill 0.3)
  Top 0.203: v24.79,28.85 24.08,29.56 R15.1 | U1.36 30.99,23.86 30.99,24.27 v30.48,24.78
  Bottom 0.203: v30.48,24.78 28.85,24.78 v24.79,28.85
MAG_DRDY  (via drill 0.3)
  Top 0.203: v29.26,18.79 29.26,18.69 29.16,18.59 29.16,18.18 29.66,17.67 U1.27 | U11.15 22.1,11.93 v22.35,12.18
  Route2 0.203: v22.35,12.18 22.45,12.28 22.45,13.2 24.99,15.75 25.09,15.75 27.03,17.68 28.55,17.68 29.16,18.29 29.16,18.69 v29.26,18.79
MPU_CS  (via drill 0.3)
  Top 0.203: U14.8 25.02,4.2 v25.3,4.47 | v29.57,12.09 29.57,14.63 29.87,14.94 29.87,16.77 U1.26
  Route2 0.203: v28.04,6.5 28.04,10.57 v29.57,12.09
  Bottom 0.203: v25.3,4.47 25.3,5.49 25.81,5.99 27.53,5.99 v28.04,6.5
N$1
  Top 0.203: U1.6 19.82,17.67 19.2,17.06 19.2,16.24 X1.1 18.83,15.53 C4.2
N$2
  Top 0.203: U1.5 19.46,18.03 17.48,16.05 16.25,16.05 X1.3 15.75,15.9 15.75,15.33 15.27,14.85 C3.1
N$3  (via drill 0.3)
  Top 0.381: J1.2 6.8,16.16 7.01,15.95 7.01,14.43 6.6,14.02 6.2,14.02 v6.2,13.92
  Top 0.635: v11.07,15.34 11.99,15.34 L2.2
  Route2 0.635: v6.2,13.92 6.2,14.33 7.21,15.34 v11.07,15.34
N$4  (via drill 0.3)
  Top 0.254: R22.2 7.32,31.6 v7.01,31.9
  Top 0.381: v5.79,34.44 D2.3
  Bottom 0.254: 5.79,32.47 6.45,32.47 v7.01,31.9
  Bottom 0.381: v5.79,34.44 5.79,32.47 J7.1
N$5
  Top 0.305: F2.2 11.71,7.13 12.65,6.19 12.65,6.1 L3.1
N$8
  Top 0.203: L5.2 7.43,5.29 6.81,4.67 5.67,4.67 J4.2
N$9
  Top 0.203: U7.4 35.77,12.37 C16.1
N$10
  Top 0.254: U11.8 23.1,7.28 23.57,6.81 24.13,6.81 C24.1
N$11
  Top 0.203: J4.3 5.74,5.99 6.2,5.99 7.12,6.92 7.12,7.03 L4.2
N$12  (via drill 0.3)
  Top 0.203: J1.11 4.97,27.41 v4.17,26.61 | U2.8 11.44,25.26 11.07,24.89 10.17,24.89 v10.16,24.88
  Bottom 0.203: v4.17,26.61 4.28,26.72 4.67,26.72 5.9,25.49 7.82,25.49 7.82,25.5 8.44,24.88 v10.16,24.88
N$13  (via drill 0.3)
  Top 0.203: U2.1 11.44,23.81 v11.08,24.18 v11.07,24.18 | J1.10 4.63,26.16 v4.27,25.8
  Bottom 0.203: 8.33,24.28 7.62,24.99 5.59,24.99 4.67,25.91 4.38,25.91 v4.27,25.8 | 8.33,24.28 | 8.33,24.28 10.96,24.28 v11.07,24.18
N$14
  Top 0.635: L1.2 7.15,9.07 7.62,9.54 7.84,9.54 Q2.4
N$15
  Top 0.203: 8.39,26.34 U3.8 8.39,26.76 8.03,27.13 7.52,27.13 6.91,27.74 6.91,28.45 6.71,28.65 J1.12
N$16
  Top 0.203: U3.1 8.36,23.16 7.62,23.16 6.91,23.88 6.91,24.69 6.68,24.91 J1.9
N$17
  Top 0.254: U11.12 24.02,10.19 24.02,10.39 24.38,10.76
  Top 0.406: 24.38,10.76 25.6,10.76 26.31,10.05 26.31,7.11 25.98,6.78 C24.2
N$18
  Top 0.305: JP2.2 13.76,2.78 14.83,3.85 14.83,4.87 13.82,5.88 13.82,6.49 13.41,6.9 13.25,6.9 F2.1
N$20  (via drill 0.3)
  Top 0.203: J3.12 44.88,22.01 v44.91,22.04
  Bottom 0.203: v44.91,22.04 43.35,22.04 J3.12
N$21  (via drill 0.3)
  Top 0.203: v12.5,17.57 12.7,17.77 12.7,18.38 12.72,18.39 RN1.5
  Route2 0.203: v12.5,17.57 12.39,17.47 5.49,17.47 v4.17,18.79
  Bottom 0.203: v4.17,18.79 U13.P$2
N$23
  Top 0.635: L8.1 34.21,26.98 D1.ANODE
N$24  (via drill 0.5)
  Top 0.381: L3.2 10.79,5.76 v10.77,5.78
  Top 0.406: J4.1 5.64,2.48 v5.38,2.23
  Bottom 0.406: v10.77,5.78 10.66,5.78 10.36,5.49 8.33,5.49 6.6,3.76 6.6,3.45 v5.38,2.23
N$25  (via drill 0.3)
  Top 0.254: R22.1 7.88,29.42 8.33,29.87 v8.33,30.68
  Top 0.381: v8.33,30.68 8.71,30.68 Q3.3
  Bottom 0.381: v8.33,30.68 7.62,30.68 7.25,31.05 J7.2
N$26  (via drill 0.3)
  Top 0.203: v13.41,17.57 13.51,17.67 RN1.6
  Route2 0.203: v13.41,17.57 12.8,16.96 5.24,16.96 4.4,17.8 4.24,17.8 v4.17,17.87
  Bottom 0.203: U13.P$3 3.98,17.68 v4.17,17.87
N$27
  Top 0.635: L2.1 13.37,16.67 F1.2
N$28
  Top 0.203: R15.2 26.26,33.18 LED3.C
N$29
  Top 0.203: R13.2 25.5,31.1 27.58,33.18 LED1.C
N$30
  Top 0.203: R14.2 24.89,33.18 LED2.C
N$31  (via drill 0.3)
  Top 0.203: v14.33,17.57 RN1.7
  Route2 0.203: v14.33,17.57 14.33,17.37 13.41,16.45 4.52,16.45 3.45,15.38 3.45,14.01 3.47,14.01 v4.17,13.31
  Bottom 0.203: U13.P$7 4.15,13.28 v4.17,13.31
N$32  (via drill 0.3)
  Top 0.203: v15.14,17.57 15.14,18.48 RN1.8
  Route2 0.203: v15.14,17.57 15.14,17.37 13.82,16.05 4.98,16.05 v4.17,15.23
  Bottom 0.203: U13.P$5 3.91,15.48 v4.17,15.23
N$34
  Top 0.254: U12.14 35.72,3.02 C25.1
N$35
  Top 0.203: L10.1 10.15,8.74 R11.2
N$36
  Top 0.254: U11.10 24.64,9.19 24.79,9.34 25.14,9.34 C23.1
N$40
  Top 0.254: U14.20 29.28,2.7 C20.1
N$41
  Top 0.635: J1.1 5.62,14.91 5.2,14.5 5.2,11.81 Q2.1 Q2.2 Q2.5 Q2.6
N$42
  Top 0.254: U14.10 23.31,3.2 22.45,4.06 C26.1
N$44  (via drill 0.3)
  Top 0.254: U14.12 24.76,2.2 v24.99,2.43
  Bottom 0.254: v24.99,2.43 24.89,2.33 JP6.2
N$100
  Top 0.254: 41.07,12.37 C14.1
  Top 0.508: C14.1 L11.2 | 41.07,12.37 U7.3 38.54,12.37 38.3,12.13 38.3,10.84 38.67,10.47 U7.1
OTG_DM
  Top 0.203: R6.1 33.31,29.99 J5.D-
OTG_DP
  Top 0.203: J5.D+ 32.66,30.12 32.33,29.78 R8.1
OTG_FS_DM
  Top 0.203: U1.44 28.49,27.02 29.94,28.47 R6.2
OTG_FS_DP
  Top 0.203: U1.45 28.39,27.63 29.57,28.8 R8.2
PB2-BOOT1
  Top 0.203: U1.28 30.58,17.48 30.58,17.26 30.28,16.96 30.28,14.93 30.81,14.39 R5.1
POLY1
  Route15 0.203: 45.21,2.03 44.81,2.03
  pour Route2 (rank 2): 20.52,11.28 24.18,11.28 24.18,8.23 23.57,7.62 20.52,7.62
POLY2
  Route2 0.203: 45.41,2.03 45.82,2.03
  pour Route15: 20.52,11.28 24.18,11.28 24.18,8.23 23.57,7.62 20.52,7.62
PPM_INPUT  (via drill 0.3)
  Top 0.203: v45.92,8.02 45.92,8.93 v46.94,9.95 48.57,9.95 J2.23 | v17.78,10.96 18.39,10.36 18.39,10.06 R10.1 | v23.16,18.99 23.16,19.91 23.77,20.52 23.77,22.95 24.69,23.87 26.05,23.87 U1.43
  Route2 0.203: v23.16,18.99 23.16,18.79 17.78,13.4 v17.78,10.96
  Bottom 0.203: v45.92,8.02 44.91,7 41.35,7 39.12,9.24 39.12,9.25 30.79,9.25 29.98,10.05 25.7,10.05 25.59,10.16 25.6,10.16 22.86,12.9 21.13,12.9 19.4,11.17 17.98,11.17 v17.78,10.96 | J2.23 47,10.01 v46.94,9.95
PPM_INPUT_CON  (via drill 0.3)
  Top 0.203: v14.33,13.1 14.33,13.2 13.72,13.81 11.68,13.81 10.36,15.13 10.36,16.45 9.55,17.26 8.03,17.26 7.32,17.98 7.32,20.52 6.71,21.13 5.67,21.13 J1.6 | R10.2 18.36,8.3 v17.88,7.82
  Route2 0.203: v14.33,13.1 14.33,12.79 14.83,12.29 16.26,12.29 v17.07,11.47
  Bottom 0.203: v17.07,11.47 17.07,8.93 17.07,8.84 17.88,8.03 v17.88,7.82
RESET  (via drill 0.3)
  Top 0.203: U1.7 20.73,17.84 20.73,18.28 23.37,20.92 23.37,23.16 24.59,24.38 v24.59,26.61 | 16.72,33.01 S1.A1 15.15,33.02 v15.04,32.91 14.73,32.91 14.22,32.4 14.22,31.51 13.38,30.66 | 13.38,30.66 R16.1 | 13.38,30.66 C17.2 14.68,29.2 v15.44,28.44
  Bottom 0.203: v24.59,26.61 22.86,28.34 21.13,28.34 20.83,28.03 16.56,28.03 16.15,28.44 v15.44,28.44 | !RESET.P$1 14.17,32.91 v15.04,32.91
SPI1_MISO  (via drill 0.3)
  Top 0.203: U1.22 28.55,15.27 28.55,8.73 29.36,7.92 v29.57,7.92 30.07,7.92 31.64,6.35 U12.4 | U14.9 24.54,3.7 v24.79,3.45 | U15.1 33.29,8.37 v33.63,8.03
  Bottom 0.203: v24.79,3.45 24.59,3.66 24.59,6.08 SPI1_MISO.P$1 26.18,6.46 26.18,6.47 27.03,7.32 27.94,7.32 28.65,8.03 29.46,8.03 v29.57,7.92 31.89,7.92 32.21,8.23 33.43,8.23 v33.63,8.03
SPI1_MOSI  (via drill 0.3)
  Top 0.203: U1.23 28.96,15.57 28.96,9.03 29.46,8.53 v30.28,8.53 32.09,6.72 v32.29,6.72 U12.3 | U14.24 28.67,4.7 28.85,4.88 v28.85,6.19 | U15.2 33.99,10.11 34.24,9.86 v34.24,7.42
  Route2 0.203: v28.85,6.19 v28.85,6.2 29.77,7.11 29.87,7.11 30.28,7.52 v30.28,8.53
  Bottom 0.203: v30.28,8.53 27.98,8.53 SPI1_MOSI.P$1 | v34.24,7.42 33.12,7.42 32.42,6.72 v32.29,6.72
SPI1_SCK  (via drill 0.3)
  Top 0.203: v28.96,7.41 28.14,8.22 28.14,14.97 U1.21 | U14.23 29.3,4.2 29.77,4.67 v29.77,6.19 | U15.12 32.76,7.96 v32.31,7.51 32.52,7.51 32.77,7.26 32.92,7.11 32.94,7.09 U12.2
  Bottom 0.203: v28.96,7.41 | v32.31,7.51 32.11,7.31 29.06,7.31 v28.96,7.41 | v28.96,7.41 29.77,6.6 v29.77,6.19 30.04,6.46 SPI1_SCK.P$1
SPI3_MISO  (via drill 0.3)
  Top 0.203: v22.05,21.94 22.05,23.05 23.06,24.07 23.06,25.7 U1.52 | RN1.2 14.33,20.62 14.63,20.92 v15.85,20.92 15.93,20.92 16.03,21.02 16.03,22.15 15.54,22.63 R23.1 | RN1.2 14.33,20 | RN1.2
  Bottom 0.203: v15.85,20.92 15.95,21.02 17.17,21.02 17.78,21.63 21.74,21.63 v22.05,21.94
SPI3_MOSI  (via drill 0.3)
  Top 0.203: v21.23,22.34 21.23,24 U1.57 | RN1.3 13.51,21.13 14.12,21.74 v15.44,21.74
  Bottom 0.203: v21.23,22.34 21.09,22.2 17.6,22.2 17.14,21.74 v15.44,21.74
SPI3_NSS  (via drill 0.3)
  Top 0.203: U1.20 26.62,15.78 26.62,20.31 26.72,20.41 v26.72,20.52 | v15.85,19.3 13.01,19.3 12.72,19.58 RN1.4
  Bottom 0.203: v26.72,20.52 26.62,20.62 23.98,20.62 23.77,20.82 18.39,20.82 17.48,19.91 16.66,19.91 16.05,19.3 v15.85,19.3
SPI3_SCK  (via drill 0.3)
  Top 0.203: v22.76,21.53 22.76,23.16 23.47,23.87 23.47,26 U1.51 | v15.85,20.11 15.13,20.11 RN1.1
  Bottom 0.203: v15.85,20.11 16.15,20.41 17.27,20.41 18.09,21.23 22.45,21.23 v22.76,21.53
UART5_RX  (via drill 0.3, 0.3 pad 0.51)
  Top 0.203: v44.91,17.98 43.35,17.98 J2.16 | v20.83,27.12 20.83,26.52 U1.54
  Bottom 0.203: v44.91,17.98 44.87,18.01 J2.16 43.29,17.98 41.66,17.98 40.34,19.3 32.11,19.3 26.82,24.58 24.99,24.58 22.45,27.12 v20.83,27.12
UART5_TX  (via drill 0.3)
  Top 0.203: J2.15 46.97,18.01 v46.94,17.98 | v21.44,27.73 21.44,26.62 U1.53
  Bottom 0.203: J2.15 46.97,18.01 v46.94,17.98 45.92,18.99 41.66,18.99 40.95,19.7 32.31,19.7 26.92,25.09 25.2,25.09 22.55,27.73 v21.44,27.73
USART1_RX  (via drill 0.3)
  Top 0.203: v20.32,22.85 20.42,22.95 20.42,23.4 U1.59 | v11.99,19.19 11.99,18.89 11.07,17.98 9.97,17.98 U4.4
  Bottom 0.203: v20.32,22.85 20.12,23.05 15.34,23.05 15.27,23.05 14.86,22.65 14.86,21.74 14.86,21.67 14.53,21.34 13.11,21.34 13.11,21.33 11.99,20.21 v11.99,19.19
USART1_RX_EXT  (via drill 0.3)
  Top 0.203: J2.8 43.41,26.1 v44.91,26.1 | U4.1 8.29,17.95 7.82,18.42 7.82,21.13 6.54,22.41 J1.7 4.5,22.41 4.27,22.65 4.27,23.47 v3.66,24.08
  Bottom 0.203: v44.91,26.1 44.81,26.01 J2.8 41.65,26.01 40.84,26.81 37.29,26.81 34.14,29.96 11.88,29.96 10.97,29.06 4.38,29.06 4.37,29.05 3.56,29.86 1.11,29.86 0.81,29.57 0.81,27.53 2.64,25.7 3.45,25.7 3.96,25.2 3.96,24.38 v3.66,24.08
USART1_TX  (via drill 0.3)
  Top 0.203: U1.58 19.71,24.81 v19.71,25.39 | v14.53,25.19 13.92,24.58 13.92,22.85 13.41,22.34 10.67,22.34 9.89,21.57 U4.5
  Bottom 0.203: v19.71,25.39 19.71,25.29 19.3,24.88 14.83,24.88 v14.53,25.19
USART1_TX_EXT  (via drill 0.3)
  Top 0.203: J2.7 47.03,26.01 v46.94,26.1 | v3.35,24.99 3.55,24.79 3.86,24.79 4.99,23.66 J1.8 6.51,23.66 7.42,22.76 7.42,22.25 8.03,21.64 8.03,21.52 U4.8
  Bottom 0.203: J2.7 47.03,26.01 v46.94,26.1 46.91,26.1 45.99,27.02 41.66,27.02 41.45,27.22 37.49,27.22 34.34,30.37 11.68,30.37 10.77,29.46 4.57,29.46 3.76,30.28 0.91,30.28 0.41,29.77 0.41,27.33 2.74,24.99 v3.35,24.99 3.36,24.99
USART2_CTS  (via drill 0.3, 0.3 pad 0.51)
  Top 0.203: U1.14 24.38,16.55 v24.38,22.65 | J2.19 47.04,14.01 v46.94,13.91 | v13.11,25.29 12.94,25.45 U2.5
  Route2 0.203: v39.52,18.38 39.62,18.38 42.98,15.03 45.82,15.03 v46.94,13.91
  Bottom 0.203: v39.52,18.38 39.42,18.38 38.81,17.77 33.02,17.77 28.14,22.65 v24.38,22.65 22.55,24.48 14.33,24.48 13.51,25.29 v13.11,25.29 | v46.94,13.91 48.53,13.91 J2.19
USART2_RTS  (via drill 0.3, 0.3 pad 0.51)
  Top 0.203: v24.99,22.04 24.89,21.94 24.89,16.35 U1.15 | J2.20 44.81,14.01 44.81,14.02 v44.91,14.11 | v13.11,24.38 12.94,24.21 U2.4
  Route2 0.203: v39.52,17.57 42.98,14.11 v44.91,14.11
  Bottom 0.203: v39.52,17.57 39.32,17.37 32.82,17.37 28.14,22.04 v24.99,22.04 24.08,22.04 22.05,24.07 13.41,24.07 v13.11,24.38 | v44.91,14.11 43.42,14.11 J2.20
USART2_RX  (via drill 0.3, 0.3 pad 0.51)
  Top 0.203: v26.01,21.23 26.11,21.12 26.11,16.25 25.6,15.74 25.6,14.68 U1.17 | J2.22 44.78,12.01 v44.91,11.88 45.52,12.49 45.52,16.45 44.91,17.06 42.06,17.06 v41.76,17.37 | U3.4 9.89,23.49 10,23.6 10.41,23.6 v10.47,23.66
  Bottom 0.203: J2.22 43.45,11.88 v44.91,11.88 | v41.76,17.37 41.35,16.96 32.61,16.96 28.35,21.23 v26.01,21.23 24.09,21.23 21.74,23.57 10.55,23.57 v10.47,23.66
USART2_TX  (via drill 0.3)
  Top 0.203: v25.6,23.26 25.6,21.73 25.4,21.53 25.4,17.77 | U1.16 25.4,16.15 25.4,17.77 | J2.21 47.01,12.01 v46.94,12.08 | 25.4,17.77 v25.5,17.77 | U3.5 9.89,25.77 10.16,25.5 10.76,25.5 v10.77,25.49
  Bottom 0.203: J2.21 48.55,12.08 v46.94,12.08 45.82,10.96 41.76,10.96 40.13,12.59 34.85,12.59 33.43,14.01 29.26,14.01 v25.5,17.77 | v25.6,23.26 24.59,23.26 22.76,25.09 21.03,25.09 19.5,26.62 16.15,26.62 15.95,26.42 12.39,26.42 11.47,25.49 v10.77,25.49
USART6_RX  (via drill 0.3)
  Top 0.203: v27.94,20.62 27.94,22.23 U1.38 | v9.45,6.8 8.83,6.8 8.83,6.83 L4.1 | v44.91,20.01 J3.14 45.41,20.01 45.92,19.5 45.92,15.94 v46.94,14.93
  Route2 0.203: v27.94,20.62 27.74,20.62 25.6,18.48 25.3,18.48 24.89,18.08 24.89,17.06 20.62,12.79 19.2,12.79 18.49,12.08 18.49,10.76 16.66,8.93 13.21,8.93 11.28,7 9.65,7 v9.45,6.8
  Bottom 0.203: USART6_RX.P$1 8.01,8.54 9.45,7.1 v9.45,6.8 | J3.14 v44.91,20.01 | v46.94,14.93 46.94,14.83 45.21,13.1 36.17,13.1 34.34,14.93 30.99,14.93 28.65,17.26 28.65,18.89 27.94,19.6 v27.94,20.62
USART6_TX  (via drill 0.3)
  Top 0.203: U1.37 28.65,22.23 v28.65,19.8 | v9.96,6.19 9.73,5.96 L5.1 | v46.94,16.96 46.33,17.57 46.33,19.5 46.84,20.01 v46.94,20.01 J2.13
  Route2 0.203: v28.65,19.8 27.53,19.8 26.11,18.38 26.11,17.47 20.73,12.09 20.42,12.09 16.86,8.53 13.41,8.53 11.48,6.6 10.36,6.6 v9.96,6.19
  Bottom 0.203: 7.51,5.99 USART6_TX.P$1 7.69,6.19 v9.96,6.19 | v46.94,16.96 46.84,17.06 42.32,17.06 41.81,16.55 32.41,16.55 29.16,19.8 v28.65,19.8 | v46.94,20.01 J2.13
VBAT_IN  (via drill 0.3)
  Top 0.203: L10.2 9.23,10.04 v9.04,9.86
  Top 0.381: D2.1 6.72,33.53 3.35,33.53 2.13,32.31 2.13,21.54 v2.74,20.93 3.76,19.91 J1.5
  Bottom 0.203: v2.74,20.93 2.03,20.93 1.52,20.42 1.52,10.26 1.93,9.86 v9.04,9.86
VBUS
  Top 0.254: 33.96,28.79 L8.2 33.14,28.66 30.79,26.31 29.19,26.31 U1.42
  Top 0.406: 33.96,28.79 J5.VBUS
VCAP_1
  Top 0.203: 32.59,17.59 U1.31
  Top 0.254: 32.59,17.59 32.62,17.59 C11.1
VCAP_2
  Top 0.203: U1.47 27.18,27.83 27.18,28.53 C12.1
VDD_3V3  (via drill 0.3)
  Top 0.203: R23.2 15.54,25.09 14.53,26.11 14.53,27.72 JP1.1
  Top 0.254: R19.2 R20.2 15.57,10.18 v16.36,10.96 | LED1.A LED3.A LED2.A 23.56,35.18 J6.1 | U1.19 27.53,14.16 27.53,13.1 v27.23,12.79 | U1.48 26.14,28.47 v26.42,28.75 26.67,29 26.67,29.41 26.87,29.61 C9.1 | U1.32 32.47,19.44 v33.22,18.69 34.06,17.85 C8.1 | U6.4 38.3,24.15 | 38.3,17.57 38.3,17.85 U6.2 | R9.2 R7.2 44.64,33.68 v44.7,33.62 | U4.6 U4.7 | U2.3 12.44,25.29 | 12.44,25.29 U2.6 | U3.6 U3.3 U4.6 | U4.6 9.39,20.01 10.26,20.01 10.57,20.31 v10.57,20.82 11.32,21.57 C2.1 | U1.64 U1.1 17.11,19.44 v16.87,19.19 16.87,20.2 C10.1 | 12.44,25.29 v12.19,25.29 | v15.95,27.73 JP1.1 14.53,28.35 14.38,28.49 13.72,28.49 13.21,29 R16.2 | U8.8 14.41,6.71 14.02,7.1 14.02,7.61 v13.92,7.71 | U4.3 9.39,18.64 9.55,18.8 10.36,18.8 10.57,18.59 v10.57,18.59 | U5.1 8.39,12.46 8.23,12.29 7.01,12.29 v6.81,12.09 | U15.3 33.87,10.61 v34.04,10.77 | U12.1 33.59,6.74 v33.53,6.8
  Top 0.508: JP2.3 13.63,4.08 v13.92,4.37
  Top 0.635: U6.2 37.9,18.36 v37.9,21.94 | C6.A 36.57,15.84 38.3,17.57 | F1.1 14.41,15.39 v14.6,15.2
  Bottom 0.254: VDD_3V3.P$1 25.84,35.07 J6.1
  Bottom 0.381: v4.22,17.01 4.22,16.92 3.86,16.56 2.88,16.56 U13.P$4
  other vias: 38.3,22.55 39.01,22.55 38.61,21.94 37.59,22.55 37.19,21.94 36.88,22.55 36.47,21.94 35.66,21.94 36.07,22.55
  pour Route2 (rank 3): -0.41,36.46 -0.41,-0.3 50.7,-0.3 50.7,36.46
  pour Top (no thermals): 40.03,26.92 32.41,26.92 32.41,20.31 33.22,19.5 40.03,19.5
  pour Bottom: 32.61,20.62 32.61,25.6 41.05,25.6 41.05,20.62
VDD_3V3_ANALOG  (via drill 0.3)
  Top 0.254: U1.13 22.32,15.2 21.59,14.47 21.59,13.2 C15.1 21.39,12.93 21.46,13 | 20.12,8.84 20.12,9.55 20.26,9.69 U11.2 | 35.05,5.88 34.51,5.35 U12.16 U12.15 | 35.05,5.88 35.62,5.88 C21.1 | 35.05,5.88 35.05,7 v35.97,7.92 | 20.27,8.69 U11.4 | 20.27,8.69 20.12,8.84 | 20.12,8.84 20.12,8.83 | 20.27,8.69 20.14,8.69 C19.1 | 24.59,1.37 C28.1 22.2,1.37 21.64,0.81 20.73,0.81 20.2,1.34 U10.5 U10.4 | 24.59,1.37 24.63,1.37 | U14.13 24.59,1.37 | U11.13 23.1,11.55 C22.1 | v30.89,12.08 v30.89,12.07 30.46,12.07 30.07,11.68 30.07,11.44 C18.1 29.95,11.11 U15.7
  Top 0.305: C28.1 23.47,1.37 v23.47,1.32
  Top 0.381: C13.A 36.02,7.87 v35.97,7.92 | C19.1 18.29,6.84 18.29,6.39 18,6.11 U10.1 | C22.1 23.96,11.8 24.38,11.38 25.91,11.38 27.03,10.26 v27.03,8.13
  Top 0.508: U7.5 37.34,10.06 C13.A | 21.46,13 23.38,13 C22.1 | v16.97,5.58 17.01,5.63 U10.1 U10.2
  Route2 0.381: 32,5.99 34.94,5.99 35.97,7.01 v35.97,7.92 | 32,5.99 30.99,7 30.99,11.98 v30.89,12.08 | 32,5.99 31.5,5.48 31.49,5.49 25.91,5.49 | v23.47,1.32 23.77,1.63 v23.77,5.48 23.78,5.49 25.91,5.49 | v27.03,8.13 27.03,7.52 25.91,6.4 25.91,5.49
  Bottom 0.305: v23.47,1.32 23.47,1.42
  Bottom 0.381: v16.97,5.59 22.39,5.59 VDDA_3V3.P$1 23.71,5.55 v23.77,5.48
  Bottom 0.508: v16.97,5.59 v16.97,5.58
VDD_5V  (via drill 0.3, 0.5, 0.6)
  Top 0.254: 40.66,16.45 40.66,16.36 | R1.2 R2.2 17.58,31.39 v17.17,31.79
  Top 0.305: v10.57,30.37 10.62,30.32 10.62,29.08 11.92,27.78 JP1.3
  Top 0.381: JP2.1 13.35,1.48 v13.82,1.01 | v7.72,35.46 6.76,35.46 D2.2
  Top 0.508: v40.84,28.14 40.84,27.12 | L1.1 8.74,8.53 9.55,7.71 v9.86,7.71
  Top 0.635: L11.1 41.27,15.76 40.66,16.36 | C7.1 40.11,15.89 40.66,16.45 U6.3 40.84,18.08 C27.A | Q1.4 40.26,26.73 C27.A | 40.84,27.12 C27.A
  Route15 0.762: v9.86,7.71 5.28,12.29 5.28,28.24 6.1,29.05 9.25,29.05 v10.57,30.37
  Bottom 0.254: 17.17,31.08 v17.17,31.79
  Bottom 0.381: v7.72,35.46 5.18,35.46 4.27,34.54 4.27,33.93 3.66,33.33 3.35,33.33 3.05,33.02 3.05,31.7 4.78,29.97 10.17,29.97 v10.57,30.37
  Bottom 0.508: v9.86,7.71 10.37,7.71 12.8,5.28 12.8,2.02 v13.82,1.01
  Bottom 0.762: v10.57,30.37 11.28,31.08 17.17,31.08 34.85,31.08 36.78,29.15 39.83,29.15 v40.84,28.14
VDD_5V_IN  (via drill 0.5)
  Top 0.635: Q1.5 Q1.6 38.62,30.27 v38,30.27 37.37,30.27 Q1.1 Q1.2 35.46,28.75 D1.CATHODE
  Top 1.016: J2.2 43.33,32 v46.02,32 46.04,32.01 J2.1
  Bottom 0.635: 42.47,32 40.74,30.27 v38,30.27 | 42.47,32 v46.02,32 | J2.2 42.48,32.01 42.47,32
  Bottom 1.016: J2.2 J2.1
VDD_IO  (via drill 0.3)
  Top 0.203: U2.7 11.94,26.96 13.04,26.96 13.21,27.13 13.21,27.72 JP1.2
  Top 0.254: U5.8 8.39,14.9 v6.91,13.41 | U3.7 8.89,25.55 8.53,25.2 7.52,25.2 | v7.52,24.17 7.52,25.2 | 7.52,25.2 v7.52,26.2 | C1.1 11.79,28.85 12.09,28.55 v12.59,28.55 v12.6,28.54 12.6,28.35 JP1.2
  Bottom 0.254: v7.52,26.2 7.62,26.31 9.75,26.31 10.36,26.92 11.48,26.92 12.6,28.04 v12.6,28.54 | v7.52,24.17 6.6,23.26 6.6,15.14 6.91,14.83 v6.91,13.41

## Text on the board
tPlace: 15 | RESET | JTAG | ON | ERR | ACT | JP1 | MULTI | (c) 2012 mjs | Y | 1 | X | Z | GPS | JP2 | EXPANSION
bPlace: BUZZER | VBAT | FRONT | (+) | +5V | +5V | GND | GND | (-) | GND | CAN2RX | CAN2TX | UART1_RX | UART1_TX | I2C3_SDA | I2C3_SCL | -NC- | ADC10 | UART6_RX | UART6_TX | UART5_RX | UART5_TX | I2C2_SDA | I2C2_SCL | UART2RTS | UART2CTS | PX4FMU v1.6 | UART2_RX | UART2_TX | GPIO1 | PPM_IN | LIFT LIGHT AND PULL | ALARM | GPIO2 | ADC11 | GND | ADC13 | ADC12
tDocu: 5.0V | 5.0V | 3.3V | 3.3V